# EAGLE design dual full bridge test rev1 (EAGLE 9.5.0)
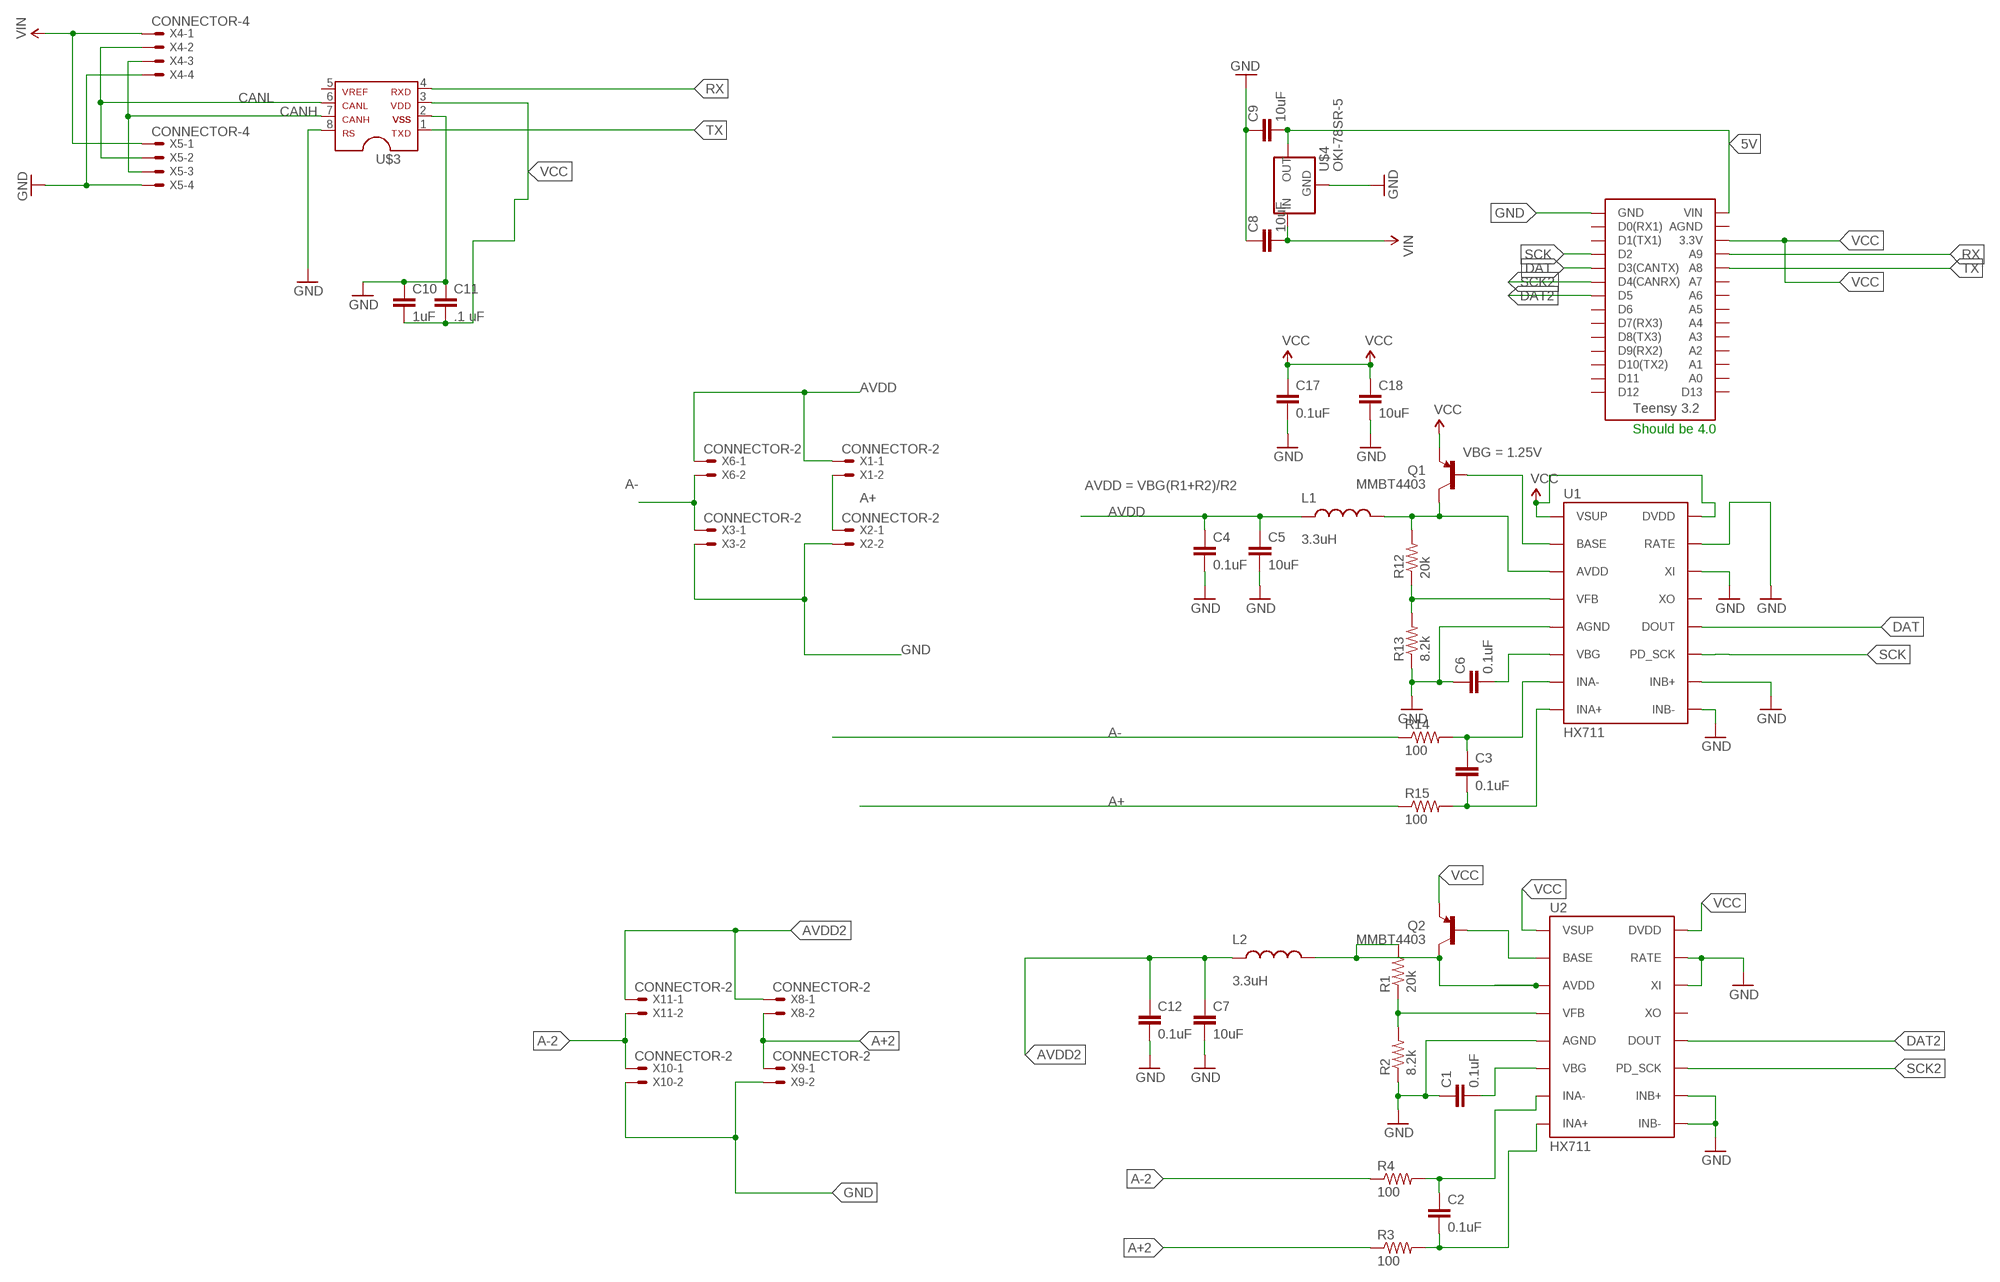
[diagram p0: schematic, sheet 1]

## Parts
C1  0.1uF  CAP0805  [0805]
C2  0.1uF  CAP0805  [0805]
C3  0.1uF  CAP0805  [0805]
C4  0.1uF  CAP0805  [0805]
C5  10uF  CAP0805  [0805]
C6  0.1uF  CAP0805  [0805]
C7  10uF  CAP0805  [0805]
C8  10uF  CAP0805  [0805]
C9  10uF  CAP0805  [0805]
C10  1uF  CAP0805  [0805]
C11  .1 uF  CAP0805  [0805]
C12  0.1uF  CAP0805  [0805]
C17  0.1uF  CAP0805  [0805]
C18  10uF  CAP0805  [0805]
L1  3.3uH  INDUCTOR0805-IND  [0805]
L2  3.3uH  INDUCTOR0805-IND  [0805]
Q1  MMBT4403  TRANSISTOR_PNPMMBT4403  [SOT23-3]
Q2  MMBT4403  TRANSISTOR_PNPMMBT4403  [SOT23-3]
R1  20k  RESISTOR0805-RES  [0805]
R2  8.2k  RESISTORAXIAL-0.3  [AXIAL-0.3]
R3  100  RESISTORAXIAL-0.3  [AXIAL-0.3]
R4  100  RESISTORAXIAL-0.3  [AXIAL-0.3]
R12  20k  RESISTOR0805-RES  [0805]
R13  8.2k  RESISTORAXIAL-0.3  [AXIAL-0.3]
R14  100  RESISTORAXIAL-0.3  [AXIAL-0.3]
R15  100  RESISTORAXIAL-0.3  [AXIAL-0.3]
U1  HX711  HX711HX711  [SO16]
U2  HX711  HX711HX711  [SO16]
U$1  TEENSY_3.2_SIMPLE  [TEENSY_3.2_SIMPLE]
U$3  MCP2551  [SOIC-08]
U$4  OKI-78SR-5  [OKI-78SR]
X1  CONNECTOR-2  [MINIFIT_5566-2]
X2  CONNECTOR-2  [MINIFIT_5566-2]
X3  CONNECTOR-2  [MINIFIT_5566-2]
X4  CONNECTOR-4  [MINIFIT_5566-4]
X5  CONNECTOR-4  [MINIFIT_5566-4]
X6  CONNECTOR-2  [MINIFIT_5566-2]
X8  CONNECTOR-2  [MINIFIT_5566-2]
X9  CONNECTOR-2  [MINIFIT_5566-2]
X10  CONNECTOR-2  [MINIFIT_5566-2]
X11  CONNECTOR-2  [MINIFIT_5566-2]

## Nets
5V: C9.2 U$1.VIN U$4.3(OUT)
A+: R15.P$1 X1.2 X2.1
A+2: R3.P$1 X8.2 X9.1
A-: R14.P$1 X3.1 X6.2
A-2: R4.P$1 X10.1 X11.2
AVDD: C4.1 C5.1 L1.1 X1.1 X6.1
AVDD2: C7.1 C12.1 L2.1 X8.1 X11.1
CANH: U$3.7 X4.3 X5.3
CANL: U$3.6 X4.2 X5.2
DAT: U1.12(DOUT) U$1.D3(CANTX)
DAT2: U2.12(DOUT) U$1.D5
GND: C1.1 C4.2 C5.2 C6.1 C7.2 C8.1 C9.1 C10.1 C11.1 C12.2 C17.2 C18.2 R2.P$1 R13.P$1 U1.5(AGND) U1.9(INB-) U1.10(INB+) U1.14(XI) U1.15(RATE) U2.5(AGND) U2.9(INB-) U2.10(INB+) U2.14(XI) U2.15(RATE) U$1.GND U$3.2 U$3.8 U$4.2(GND) X2.2 X3.2 X4.4 X5.4 X9.2 X10.2
N$1: Q2.1(B) U2.2(BASE)
N$2: C3.1 R14.P$2 U1.7(INA-)
N$3: C3.2 R15.P$2 U1.8(INA+)
N$4: Q1.1(B) U1.2(BASE)
N$5: L1.2 Q1.3(C) R12.2 U1.3(AVDD)
N$6: R12.1 R13.P$2 U1.4(VFB)
N$7: C6.2 U1.6(VBG)
N$8: C2.1 R4.P$2 U2.7(INA-)
N$9: R1.1 R2.P$2 U2.4(VFB)
N$10: C1.2 U2.6(VBG)
N$11: L2.2 Q2.3(C) R1.2 U2.3(AVDD)
N$12: C2.2 R3.P$2 U2.8(INA+)
RX: U$1.A9 U$3.4
SCK: U1.11(PD_SCK) U$1.D2
SCK2: U2.11(PD_SCK) U$1.D4(CANRX)
TX: U$1.A8 U$3.1
VCC: C10.2 C11.2 C17.1 C18.1 Q1.2(E) Q2.2(E) U1.1(VSUP) U1.16(DVDD) U2.1(VSUP) U2.16(DVDD) U$1.3.3V U$3.3
VIN: C8.2 U$4.1(IN) X4.1 X5.1
Unconnected: U1.13(XO) U2.13(XO) U$1.A0 U$1.A1 U$1.A2 U$1.A3 U$1.A4 U$1.A5 U$1.A6 U$1.A7 U$1.AGND U$1.D0(RX1) U$1.D1(TX1) U$1.D6 U$1.D7(RX3) U$1.D8(TX3) U$1.D9(RX2) U$1.D10(TX2) U$1.D11 U$1.D12 U$1.D13 U$3.5

## Notes on the sheet
- Should be 4.0
- VBG = 1.25V
- AVDD = VBG(R1+R2)/R2

## Library data of the parts
C1-C12 C17 C18 = HyTechDevices:CAP: Capacitor Standard 0603 ceramic capacitor, and 0.1" leaded capacitor.
L1 L2 = SparkFun-Passives:INDUCTOR: Inductors Basic Inductor/Choke - 0603 and 1206. Footprints are not proven and vary greatly between part numbers. INDUCTOR POWER 3.3UH 4.0A SMD 0.197" L x 0.197" W x 0.177" H (5.00mm x 5.00mm x 4.50mm); PROD_ID: NDUC-13076
Q1 Q2 = SparkFun-DiscreteSemi:TRANSISTOR_PNP: Generic PNP BJT Double check pinouts against datasheets- not all devices are the same! MMBT3906 - 40V 200mA SOT-23 (TRANS-08052) MMBT4403 - 40V 600mA SOT-23 (TRANS-09245); PROD_ID: TRANS-09245
R1-R4 R12-R15 = HyTechDevices:RESISTOR: Resistor Basic schematic elements and footprints for 0603, 1206, and PTH resistors.
U1 U2 = Testing:HX711; PROD_ID: IC-12445
U$1 = HyTechDevices:TEENSY_3.2_SIMPLE: Simple version of the Teensy 3.2 board that only uses the 2 main rows of pins, not the inner pins or the pins opposite the usb port.
U$3 = HyTechDevices:MCP2551: MCP2551 High-Speed CAN Transceiver Product Webpage <https://www.microchip.com/wwwproducts/en/MCP2551> Datasheet <http://ww1.microchip.com/downloads/en/DeviceDoc/21667f.pdf> This device is outdated It is replaced by MCP2561. Comparison Page <https://www.microchip.com/wwwproducts/ProductCompare/MCP2551/MCP2561> Product Webpage <https://www.microchip.com/wwwproducts/en/MCP2561> Datasheet <http://ww1.microchip.com/downloads/en/DeviceDoc/20005167C.pdf>
U$4 = HyTechDevices:OKI-78SR-5: Murata OKI-78SR 5V 1.5A Non-Isolated Switching Regulator DC/DC - Datasheet <https://power.murata.com/data/power/oki-78sr.pdf>
X1-X3 X6 X8-X11 = HyTechDevices:CONNECTOR-2: Mini-Fit Junior connector 2 pole Source: http://www.molex.com; OC_FARNELL: 1822072; OC_NEWARK: unknown
X4 X5 = HyTechDevices:CONNECTOR-4: Mini-Fit Junior connector 4 pole Source: http://www.molex.com; OC_FARNELL: unknown; OC_NEWARK: unknown

## Board
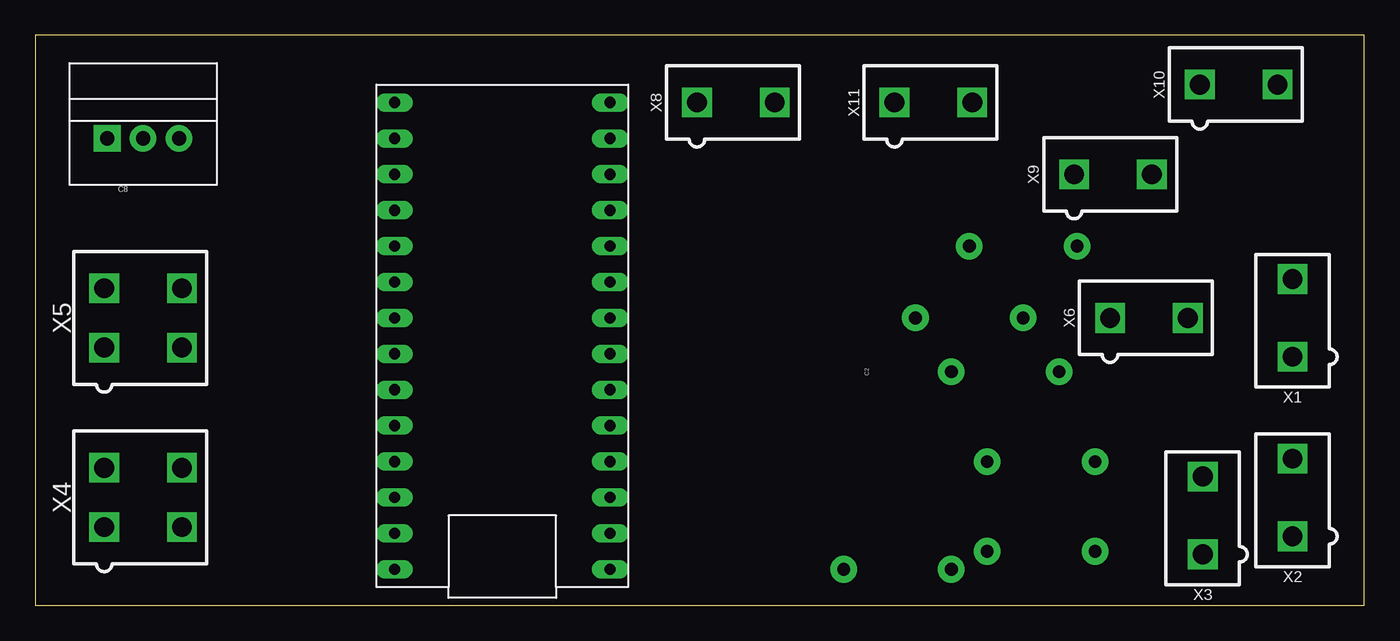
[diagram p1: board, top side]
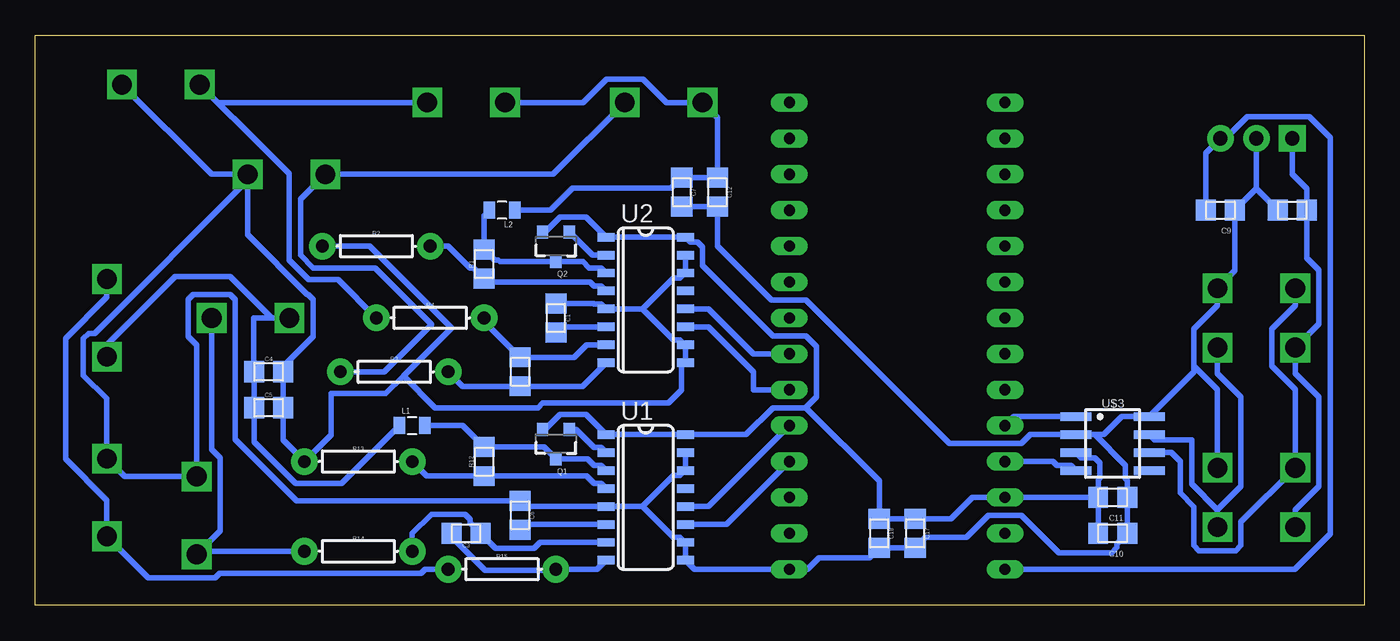
[diagram p2: board, bottom side, seen from below]

Size 93.96 x 40.31 mm. Coordinates in mm from the lower left corner, seen from the top.
Outline: 0,0 93.96,0 93.96,40.31 0,40.31 0,0
Copper layers (1*16): Top 0.035mm / dielectric 1.5mm / Bottom 0.035mm
Design rules "default *": minimum track width 6mil, minimum drill 0.35mm, track to track 16mil, track to pad 16mil, pad to pad 16mil, via to via 16mil, smd to smd 16mil, copper to edge 40mil, drill to drill 6mil, minimum pad ring 10mil, minimum via ring 8mil, stop-mask expansion 4mil, vias tented up to drill 0mil, thermal gap 10mil

### Footprints (pad centres in the part's own frame; a part is rotated, then mirrored left to right if it is on the bottom)
0805 = smd 1.4 x 1.5: 1 -1.025,0; 2 1.025,0
0805' = smd 0.8 x 1.2: 1 -0.9,0; 2 0.9,0
SOT23-3 = smd 0.8 x 0.9: 1 -0.95,-1; 2 0.95,-1; 3 0,1.1
AXIAL-0.3 = drill 0.9 pad 1.88: P$1 -3.81,0; P$2 3.81,0
SO16 = smd 0.6 x 1.2: 1 -4.445,-2.8; 2 -3.175,-2.8; 3 -1.905,-2.8; 4 -0.635,-2.8; 5 0.635,-2.8; 6 1.905,-2.8; 7 3.175,-2.8; 8 4.445,-2.8; 9 4.445,2.8; 10 3.175,2.8; 11 1.905,2.8; 12 0.635,2.8; 13 -0.635,2.8; 14 -1.905,2.8; 15 -3.175,2.8; 16 -4.445,2.8
TEENSY_3.2_SIMPLE = drill 0.8 long: 3.3V 16.51,29.21; A0 16.51,3.81; A1 16.51,6.35; A2 16.51,8.89; A3 16.51,11.43; A4 16.51,13.97; A5 16.51,16.51; A6 16.51,19.05; A7 16.51,21.59; A8 16.51,24.13; A9 16.51,26.67; AGND 16.51,31.75; D0(RX1) 1.27,31.75; D1(TX1) 1.27,29.21; D2 1.27,26.67; D3(CANTX) 1.27,24.13; D4(CANRX) 1.27,21.59; D5 1.27,19.05; D6 1.27,16.51; D7(RX3) 1.27,13.97; D8(TX3) 1.27,11.43; D9(RX2) 1.27,8.89; D10(TX2) 1.27,6.35; D11 1.27,3.81; D12 1.27,1.27; D13 16.51,1.27; GND 1.27,34.29; VIN 16.51,34.29
SOIC-08 = smd 0.6 x 2.2: 1 -1.905,-2.6; 2 -0.635,-2.6; 3 0.635,-2.6; 4 1.905,-2.6; 5 1.905,2.6; 6 0.635,2.6; 7 -0.635,2.6; 8 -1.905,2.6
OKI-78SR = drill 1 pad 1.88 square: 1 -2.54,0 | drill 1 pad 1.88: 2 0,0; 3 2.54,0
MINIFIT_5566-2 = drill 1.4 square: 1 0,-2.75; 2 0,2.75
MINIFIT_5566-4 = drill 1.4 square: 1 2.1,-2.75; 2 -2.1,-2.75; 3 2.1,2.75; 4 -2.1,2.75

### Placement (x,y rotation side)
C1  57.15,20.32 270 bottom
C2  59.69,16.51 270 bottom
C3  63.5,5.08 180 bottom
C4  77.47,16.51 0 bottom
C5  77.47,13.97 0 bottom
C6  59.69,6.35 270 bottom
C7  48.26,29.21 270 bottom
C8  5.08,27.94 0 bottom
C9  10.16,27.94 180 bottom
C10  17.78,5.08 180 bottom
C11  17.78,7.62 180 bottom
C12  45.72,29.21 270 bottom
C17  31.75,5.08 270 bottom
C18  34.29,5.08 270 bottom
L1  3.3uH  [0805']  67.31,12.7 0 bottom
L2  3.3uH  [0805']  60.96,27.94 180 bottom
Q1  57.15,11.43 180 bottom
Q2  57.15,25.4 180 bottom
R1  62.23,24.13 90 bottom
R2  69.85,25.4 0 bottom
R3  68.58,16.51 0 bottom
R4  66.04,20.32 0 bottom
R12  62.23,10.16 90 bottom
R13  71.12,10.16 0 bottom
R14  71.12,3.81 0 bottom
R15  60.96,2.54 0 bottom
U1  50.8,7.62 270 bottom
U2  50.8,21.59 270 bottom
U$1  41.91,36.83 180 top
U$3  17.78,11.43 270 bottom
U$4  7.62,33.02 0 top
X1  88.9,20.32 0 top
X2  88.9,7.62 0 top
X3  82.55,6.35 0 top
X4  7.62,7.62 270 top
X5  7.62,20.32 270 top
X6  78.74,20.32 270 top
X8  49.53,35.56 270 top
X9  76.2,30.48 270 top
X10  85.09,36.83 270 top
X11  63.5,35.56 270 top

### Tracks (layer width: path | path; a pad name or v marks a point on that pad's centre or on a via)
5V
  Bottom 0.406: C9.2 11.18,32 U$4.3 9.81,33.02 8.26,34.57 3.89,34.57 2.4,33.08 2.4,5.03 4.89,2.54 U$1.VIN
A+
  Bottom 0.406: R15.P$1 66.39,2.54 66.67,2.26 80.93,2.26 81.25,1.94 85.97,1.94 X2.1 88.9,7.41 91.83,10.34 91.83,18.87 88.9,21.8 X1.2
A+2
  Bottom 0.406: R3.P$1 69.29,16.51 65.94,19.87 69.92,23.85 74.3,23.85 75.21,24.76 75.21,28.72 X9.1 57.36,30.48 X8.2
A-
  Bottom 0.406: R14.P$1 78.74,3.81 79.23,3.81 82.34,3.81 | X6.2 81.49,11 80.89,10.4 80.89,5.26 82.34,3.81 | X3.1 82.45,3.7 82.34,3.81
A-2
  Bottom 0.406: X11.2 81.07,35.56 X10.1 77.65,32.14 76.02,30.51 76.02,24.42 74.64,23.04 72.57,23.04 R4.P$1
AVDD
  Bottom 0.406: L1.1 72.3,8.61 75.57,8.61 78.5,11.53 C5.1 C4.1 78.63,16.64 78.53,16.74 78.53,20.32 77.26,20.32 | X1.1 88.9,18.41 84.06,23.25 80.19,23.25 77.26,20.32 | 77.26,20.32 X6.1
AVDD2
  Bottom 0.406: L2.1 57.52,27.94 55.97,29.5 49,29.5 C7.1 C12.1 45.72,34.5 X8.1 49.32,35.56 50.98,37.22 53.58,37.22 55.24,35.56 X11.1
CANH
  Bottom 0.406: X5.3 10.37,16.41 8.71,14.75 8.71,8.42 10.37,6.76 | U$3.7 14.82,11.71 12.2,11.71 12.2,8.59 10.37,6.76 | X4.3 10.37,6.76
CANL
  Bottom 0.406: X5.2 4.87,21.18 6.53,19.52 6.53,16.92 4.87,15.26 X4.2 8.71,5.88 8.71,4.22 9.07,3.86 11.67,3.86 12.03,4.22 12.03,6.95 13.01,7.93 13.01,10.16 13.65,10.79 U$3.6
DAT
  Bottom 0.406: U$1.D3(CANTX) 46.36,6.98 U1.12
DAT2
  Bottom 0.406: U$1.D5 43.18,17.78 46.36,20.96 U2.12
GND
  Bottom 0.406: 12.03,16.92 12.03,19.52 10.37,21.18 X5.4 9.14,23.66 C9.1 7.62,29.46 | X4.4 10.37,15.26 12.03,16.92 | C8.1 7.62,29.46 | 7.62,29.46 U$4.2 | 19.05,12.06 18.41,12.06 17.14,13.33 U$3.8 12.03,16.49 12.03,16.92 | 19.05,12.06 U$3.2 23.59,12.06 24.22,11.44 29.32,11.44 39.46,21.58 41.9,21.58 45.72,25.4 C12.2 C7.2 | 19.05,12.06 16.89,9.9 16.89,8.97 16.75,8.84 C11.1 C10.1 17.5,4.34 17.5,4.08 17.85,3.72 21.6,3.72 24.22,6.34 26.58,6.34 28.13,4.79 31.01,4.79 C17.2 C18.2 34.99,3.35 38.54,3.35 39.35,2.54 U$1.GND 47.36,2.54 U1.9 U1.10 48.36,4.8 48.85,4.8 51.03,6.98 | U2.15 U2.14 48.36,23.14 48.85,23.14 51.03,20.96 | U1.15 U1.14 48.36,9.16 48.85,9.16 51.03,6.98 | 51.03,6.98 U1.5 59.3,6.98 C6.1 75.49,7.38 79.83,11.72 79.83,21.62 80.19,21.98 82.79,21.98 83.15,21.62 83.15,19.02 82.55,18.42 X3.2 87.63,9.1 X2.2 88.9,14.61 90.56,16.27 90.56,18.87 90.2,19.23 89.78,19.23 78.95,30.06 X9.2 | 51.03,20.96 U2.5 53.96,21.32 54.45,21.32 54.48,21.35 C1.1 | 51.03,20.96 48.85,18.78 48.36,18.78 U2.10 U2.9 48.26,16.89 48.26,15.24 49.2,14.3 58.09,14.3 58.42,13.97 65.68,13.97 67.94,16.23 | R2.P$1 70.32,25.4 64.54,19.62 67.94,16.23 | 67.94,16.23 69.21,14.96 73.03,14.96 73.03,12.06 R13.P$1 76.45,11.67 C5.2 C4.2 76.45,16.9 74.33,19.02 74.33,21.62 74.69,21.98 74.73,21.98 78.95,26.2 X9.2 | X10.2 81.49,30.48 X9.2
N$1
  Bottom 0.406: Q2.1 54.56,24.77 U2.2
N$2
  Bottom 0.406: U1.7 58.26,4.45 58.69,4.02 61.41,4.02 C3.1 63.22,5.82 63.22,6.08 63.57,6.44 65.95,6.44 67.31,5.08 R14.P$2
N$3
  Bottom 0.406: U1.8 54.23,2.54 R15.P$2 57.24,2.45 62.16,2.45 64.53,4.82 C3.2
N$4
  Bottom 0.406: U1.2 53.96,11.15 54.45,11.15 55.73,12.43 Q1.1
N$5
  Bottom 0.406: U1.3 53.96,9.88 54.45,9.88 54.9,10.33 Q1.3 58.01,11.18 R12.2 63.75,12.7 L1.2
N$6
  Bottom 0.406: U1.4 53.96,8.62 54.45,8.62 54.97,9.13 R12.1 66.28,9.13 R13.P$2
N$7
  Bottom 0.406: U1.6 59.3,5.71 C6.2
N$8
  Bottom 0.406: U2.7 55,18.42 55.88,17.54 C2.1 62.23,20.08 R4.P$2
N$9
  Bottom 0.406: U2.4 53.96,22.59 54.45,22.59 54.73,22.86 61.98,22.86 R1.1 62.97,23.85 63.23,23.85 64.79,25.4 R2.P$2
N$10
  Bottom 0.406: U2.6 56.76,19.69 C1.2
N$11
  Bottom 0.406: U2.3 53.96,23.86 54.81,23.86 55.25,24.3 Q2.3 61.11,24.3 61.23,24.42 61.49,24.42 R1.2 62.23,27.57 L2.2
N$12
  Bottom 0.406: U2.8 55.26,15.49 C2.2 63.75,15.49 R3.P$2
RX
  Bottom 0.406: U$3.4 20.74,9.88 21.73,9.88 22.01,10.16 U$1.A9
SCK
  Bottom 0.406: U1.11 45.08,5.71 U$1.D2
SCK2
  Bottom 0.406: U$1.D4(CANRX) 43.18,15.24 43.18,16.51 46.36,19.69 U2.11
TX
  Bottom 0.406: U$3.1 24.76,13.33 U$1.A8
VCC
  Bottom 0.406: C11.2 C10.2 | U$3.3 20.02,10.43 19.03,10.43 18.67,10.08 18.67,8.97 18.8,8.84 C11.2 | C11.2 U$1.3.3V 27.69,7.62 29.21,6.1 C17.1 C18.1 34.29,8.79 39.46,13.96 | 39.46,13.96 41.82,13.96 43.72,12.06 U1.16 U1.1 55.03,13.49 56.85,13.49 57.91,12.43 Q1.2 | 39.46,13.96 39.46,13.98 38.72,14.72 38.72,18.3 39.47,19.06 41.82,19.06 46.79,24.03 46.79,25.32 47.15,25.68 47.64,25.68 U2.16 U2.1 55.03,27.46 56.85,27.46 57.91,26.4 Q2.2
VIN
  Bottom 0.406: X4.1 4.87,6.76 3.21,8.42 3.21,14.75 4.87,16.41 X5.1 3.21,19.88 3.21,23.72 4.05,24.57 C8.2 4.05,29.46 5.08,30.48 U$4.1